# EAGLE design fan_control (EAGLE 9.6.2)
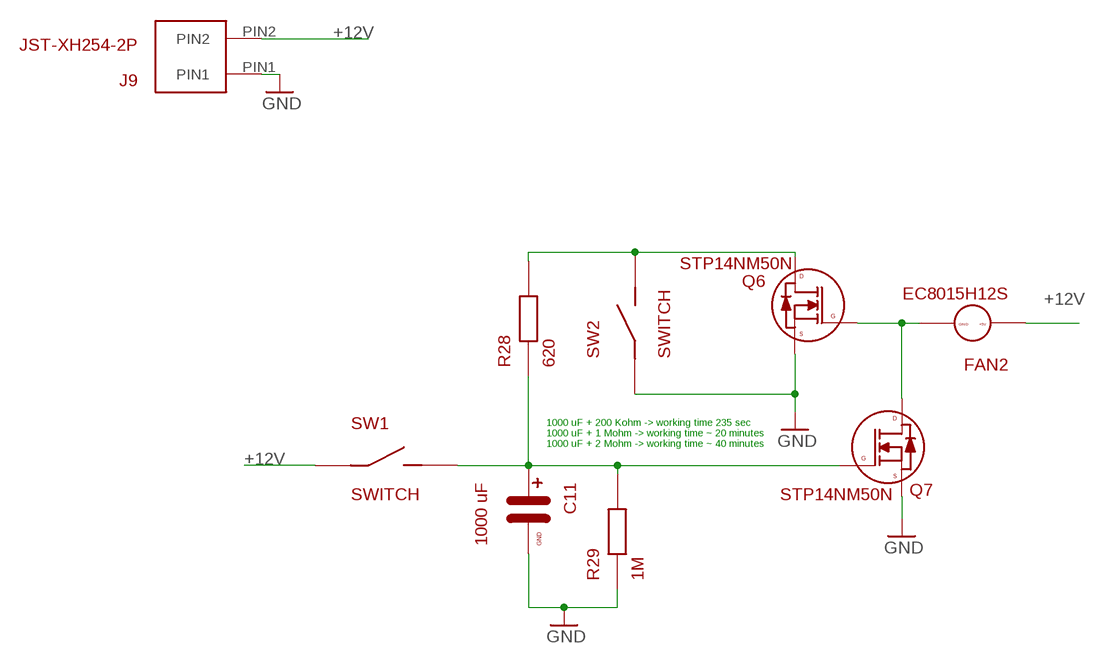
[diagram p0: schematic, sheet 1]

## Parts
C11  1000 uF  C  [C]
FAN2  EC8015H12S  FAN_5V  [FAN_5V]
J9  JST-XH254-2P  [JST-XH254-2P]
Q6  STP14NM50N  MOSFET_N  [MOSFET_N]
Q7  STP14NM50N  MOSFET_N  [MOSFET_N]
R28  620  R  [R]
R29  1M  R  [R]
SW1  SWITCH  [SWITCH]
SW2  SWITCH  [SWITCH]

## Nets
+12V: FAN2.VCC J9.PIN2 SW1.P$1
GND: C11.PIN_GND J9.PIN1 Q6.S Q7.S R29.P$1 SW2.P$1
N$22: FAN2.GND Q6.G Q7.D
N$23: C11.PIN_PLUS Q7.G R28.P$1 R29.P$2 SW1.P$2
N$24: Q6.D R28.P$2 SW2.P$2

## Notes on the sheet
- 1000 uF + 200 Kohm -> working time 235 sec
  1000 uF + 1 Mohm -> working time ~ 20 minutes
  1000 uF + 2 Mohm -> working time ~ 40 minutes

## Library data of the parts
C11 = my_devices:C
FAN2 = my_devices:FAN_5V
J9 = my_devices:JST-XH254-2P
Q6 = my_devices:MOSFET_N; SPICEPREFIX: Q
Q7 = my_devices:MOSFET_N
R28 R29 = my_devices:R
SW1 SW2 = my_devices:SWITCH

## Board
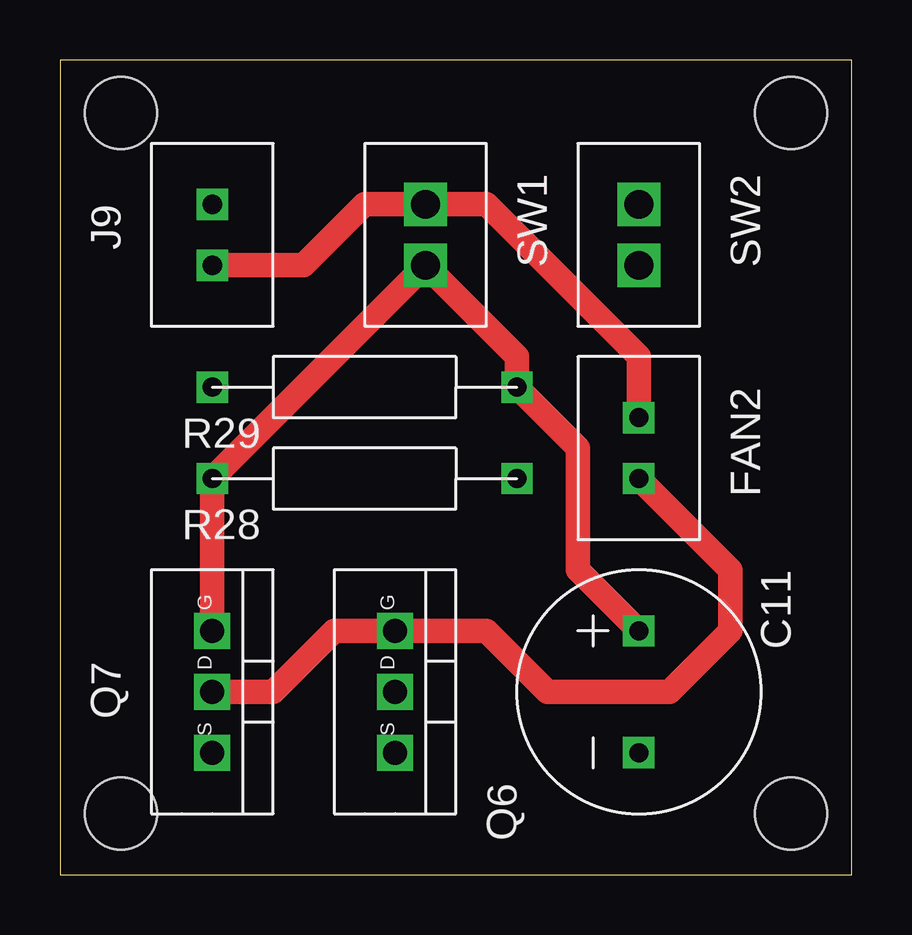
[diagram p1: board, top side]
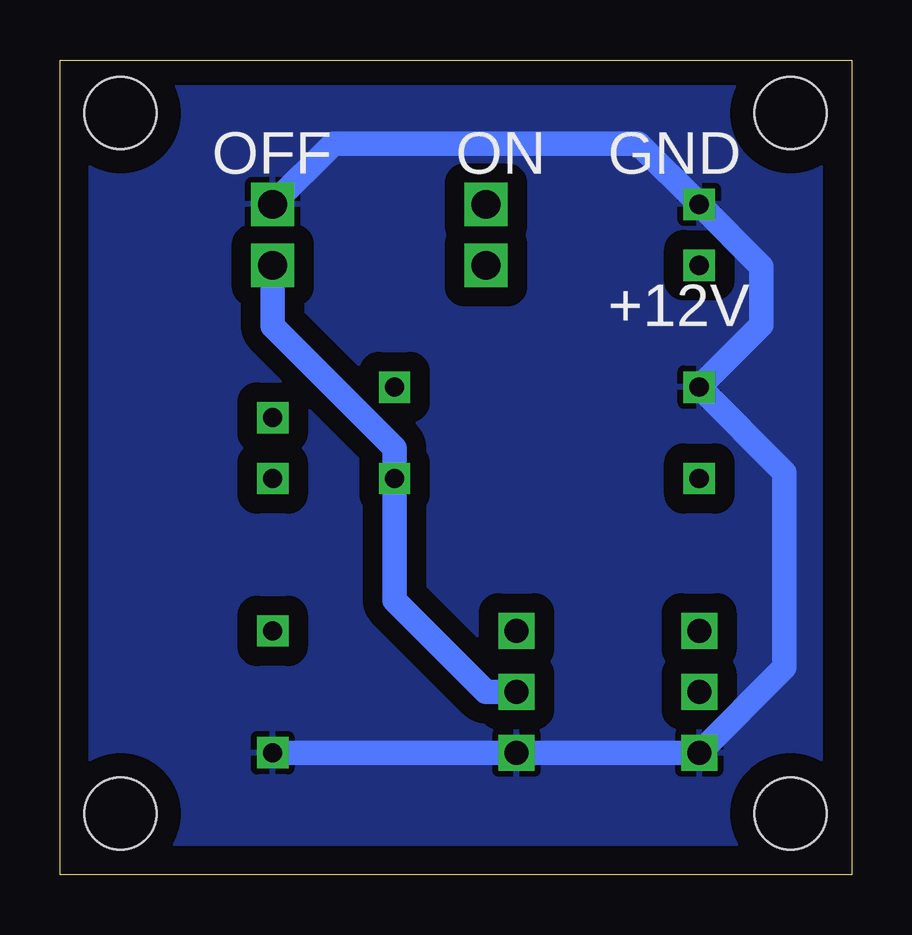
[diagram p2: board, bottom side, seen from below]

Size 33 x 33.96 mm. Coordinates in mm from the lower left corner, seen from the top.
Outline: 0,0 33,0 33,33.96 0,33.96 0,0
Copper layers (1*16): Top 0.035mm / dielectric 1.5mm / Bottom 0.035mm
Design rules "default": minimum track width 6mil, minimum drill 0.35mm, track to track 6mil, track to pad 6mil, pad to pad 6mil, via to via 6mil, smd to smd 6mil, copper to edge 40mil, drill to drill 6mil, minimum pad ring 10mil, minimum via ring 8mil, stop-mask expansion 4mil, vias tented up to drill 0mil, thermal gap 10mil
Holes 3 mm at 30.48,31.75 2.54,31.75 2.54,2.54 30.48,2.54

### Footprints (pad centres in the part's own frame; a part is rotated, then mirrored left to right if it is on the bottom)
C = drill 0.8 square: PIN_GND 2.54,0; PIN_PLUS -2.54,0
FAN_5V = drill 0.8 square: GND 1.27,0; VCC -1.27,0
JST-XH254-2P = drill 0.8 square: PIN1 -1.27,0; PIN2 1.27,0
MOSFET_N = drill 1 square: D 0,0; G -2.54,0; S 2.54,0
R = drill 0.8 square: P$1 -6.35,0; P$2 6.35,0
SWITCH = drill 1.2 square: P$1 -1.27,0; P$2 1.27,0

### Placement (x,y rotation side)
C11  24.13,7.62 270 top
FAN2  24.13,17.78 270 top
J9  6.35,26.67 270 top
Q6  13.97,7.62 270 top
Q7  6.35,7.62 270 top
R28  12.7,16.51 0 top
R29  12.7,20.32 0 top
SW1  15.24,26.67 270 top
SW2  24.13,26.67 270 top

### Tracks (layer width: path | path; a pad name or v marks a point on that pad's centre or on a via)
+12V
  Top 1.016: J9.PIN2 10.16,25.4 12.7,27.94 SW1.P$1 17.78,27.94 24.13,21.59 FAN2.VCC
GND
  Bottom 1.016: SW2.P$1 21.59,30.48 8.89,30.48 J9.PIN1 3.77,25.36 3.77,22.9 R29.P$1 2.79,16.76 2.79,8.64 Q7.S Q6.S C11.PIN_GND
  pour Bottom (isolate 0.813): 1.27,33.02 31.75,33.02 31.75,1.27 1.27,1.27
N$22
  Top 1.016: Q7.D 8.89,7.62 11.43,10.16 Q6.G 17.78,10.16 20.32,7.62 25.4,7.62 27.94,10.16 27.94,12.7 FAN2.GND
N$23
  Top 1.016: C11.PIN_PLUS 21.59,12.7 21.59,17.78 R29.P$2 19.05,21.59 SW1.P$2 R28.P$1 Q7.G
N$24
  Bottom 1.016: Q6.D 15.24,7.62 19.05,11.43 R28.P$2 19.05,17.78 24.13,22.86 SW2.P$2

### Text on the board
bNames: GND | ON | OFF | +12V